# EAGLE design ltc4300a-breakout (EAGLE 5.10)
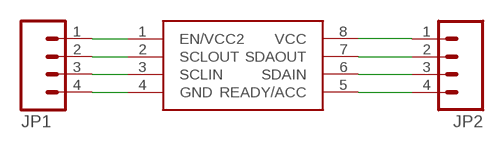
[diagram p0: schematic, sheet 1]

## Parts
JP1  M04LOCK_LONGPADS  [1X04_LOCK_LONGPADS]
JP2  M04LOCK_LONGPADS  [1X04_LOCK_LONGPADS]
U$1  LTC4300A-2  [MSOP8]

## Nets
N$1: JP1.1 U$1.1(EN/VCC2)
N$2: JP1.2 U$1.2(SCLOUT)
N$3: JP1.3 U$1.3(SCLIN)
N$4: JP1.4 U$1.4(GND)
N$5: JP2.1 U$1.8(VCC)
N$6: JP2.2 U$1.7(SDAOUT)
N$7: JP2.3 U$1.6(SDAIN)
N$8: JP2.4 U$1.5(READY/ACC)

## Library data of the parts
JP1 JP2 = SparkFun:M04: Header 4 Standard 4-pin 0.1" header. Use with straight break away headers (SKU : PRT-00116), right angle break away headers (PRT-00553), swiss pins (PRT-00743), machine pins (PRT-00117), and female headers (PRT-00115). Molex polarized connector foot print use with SKU : PRT-08231 with associated crimp pins and housings.
U$1 = ideabot:LTC4300A-2

## Board
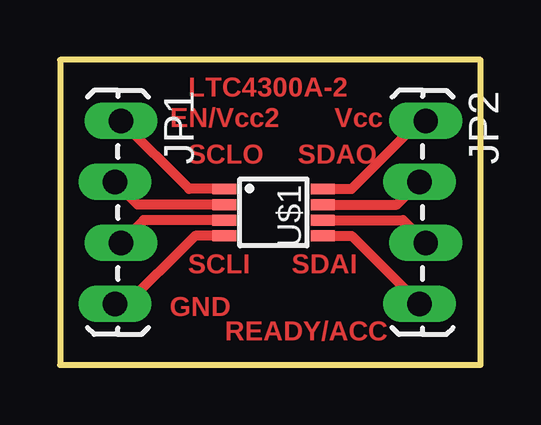
[diagram p1: board, top side]

Size 17.53 x 12.7 mm. Coordinates in mm from the lower left corner, seen from the top.
Outline: 0,0 17.53,0 17.53,12.7 0,12.7 0,0
Copper layers (1*16): Top 0.035mm / dielectric 1.5mm / Bottom 0.035mm
Design rules "default": minimum track width 10mil, minimum drill 24mil, track to track 8mil, track to pad 8mil, pad to pad 8mil, via to via 8mil, smd to smd 8mil, copper to edge 40mil, drill to drill 8mil, minimum pad ring 10mil, minimum via ring 8mil, stop-mask expansion 4mil, vias tented up to drill 0mil, thermal gap 10mil

### Footprints (pad centres in the part's own frame; a part is rotated, then mirrored left to right if it is on the bottom)
1X04_LOCK_LONGPADS = drill 1.016 long: 1 0,0; 2 2.54,-0.254; 3 5.08,0; 4 7.62,-0.254
MSOP8 = smd 0.45 x 1: 1 -0.975,-2.05; 2 -0.325,-2.05; 3 0.325,-2.05; 4 0.975,-2.05; 5 0.975,2.05; 6 0.325,2.05; 7 -0.325,2.05; 8 -0.975,2.05

### Placement (x,y rotation side)
JP1  2.54,10.16 270 top
JP2  15.24,10.16 270 top
U$1  8.89,6.35 270 top

### Tracks (layer width: path | path; a pad name or v marks a point on that pad's centre or on a via)
N$1
  Top 0.406: U$1.1 5.38,7.33 JP1.1
N$2
  Top 0.406: U$1.2 3.23,6.68 JP1.2
N$3
  Top 0.406: U$1.3 3.48,6.03 JP1.3
N$4
  Top 0.406: U$1.4 5.63,5.38 2.54,2.29 JP1.4
N$5
  Top 0.406: U$1.8 12.15,7.33 14.99,10.16 JP2.1
N$6
  Top 0.406: U$1.7 14.04,6.68 JP2.2
N$7
  Top 0.406: U$1.6 14.29,6.03 JP2.3
N$8
  Top 0.406: U$1.5 12.15,5.38 JP2.4

### Text on the board
Top: LTC4300A-2 | EN/Vcc2 | Vcc | SCLO | SDAO | SCLI | SDAI | GND | READY/ACC